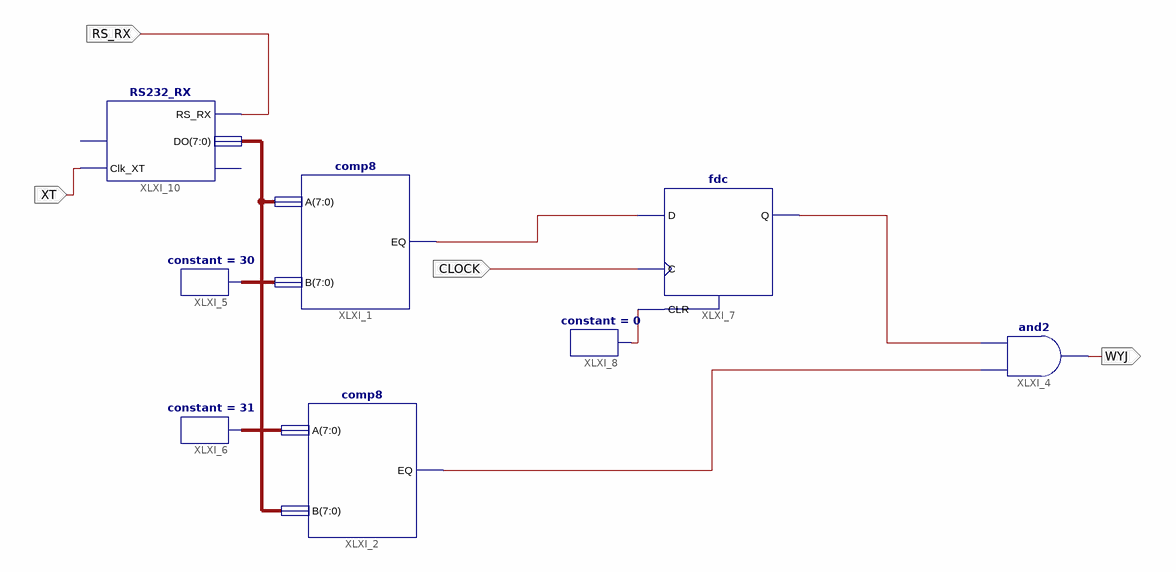
[diagram p0: schematic sheet 1]
// Xilinx ISE schematic sch1.sch (xc9500xl) as structural Verilog: 8 symbols, 4 ports
module sch1 (
  input  RS_RX,
  input  CLOCK,
  input  XT,
  output WYJ
);

  wire XLXN_2, XLXN_3, XLXN_4, XLXN_8;
  wire [7:0] XLXN_6, XLXN_11, XLXN_23;

  comp8 XLXI_1 (.A(XLXN_23), .B(XLXN_6), .EQ(XLXN_2));
  comp8 XLXI_2 (.A(XLXN_11), .B(XLXN_23), .EQ(XLXN_4));
  and XLXI_4 (WYJ, XLXN_4, XLXN_3);
  constant #(.CValue("30")) XLXI_5 (.O(XLXN_6));
  constant #(.CValue("31")) XLXI_6 (.O(XLXN_11));
  fdc XLXI_7 (.C(CLOCK), .CLR(XLXN_8), .D(XLXN_2), .Q(XLXN_3));
  constant #(.CValue("0")) XLXI_8 (.O(XLXN_8));
  RS232_RX XLXI_10 (.Clk_XT(XT), .DO(XLXN_23), .RS_RX(RS_RX));  // open: Reset, Rdy
endmodule
